# EAGLE schematic mainBoard (EAGLE 9.5.1)
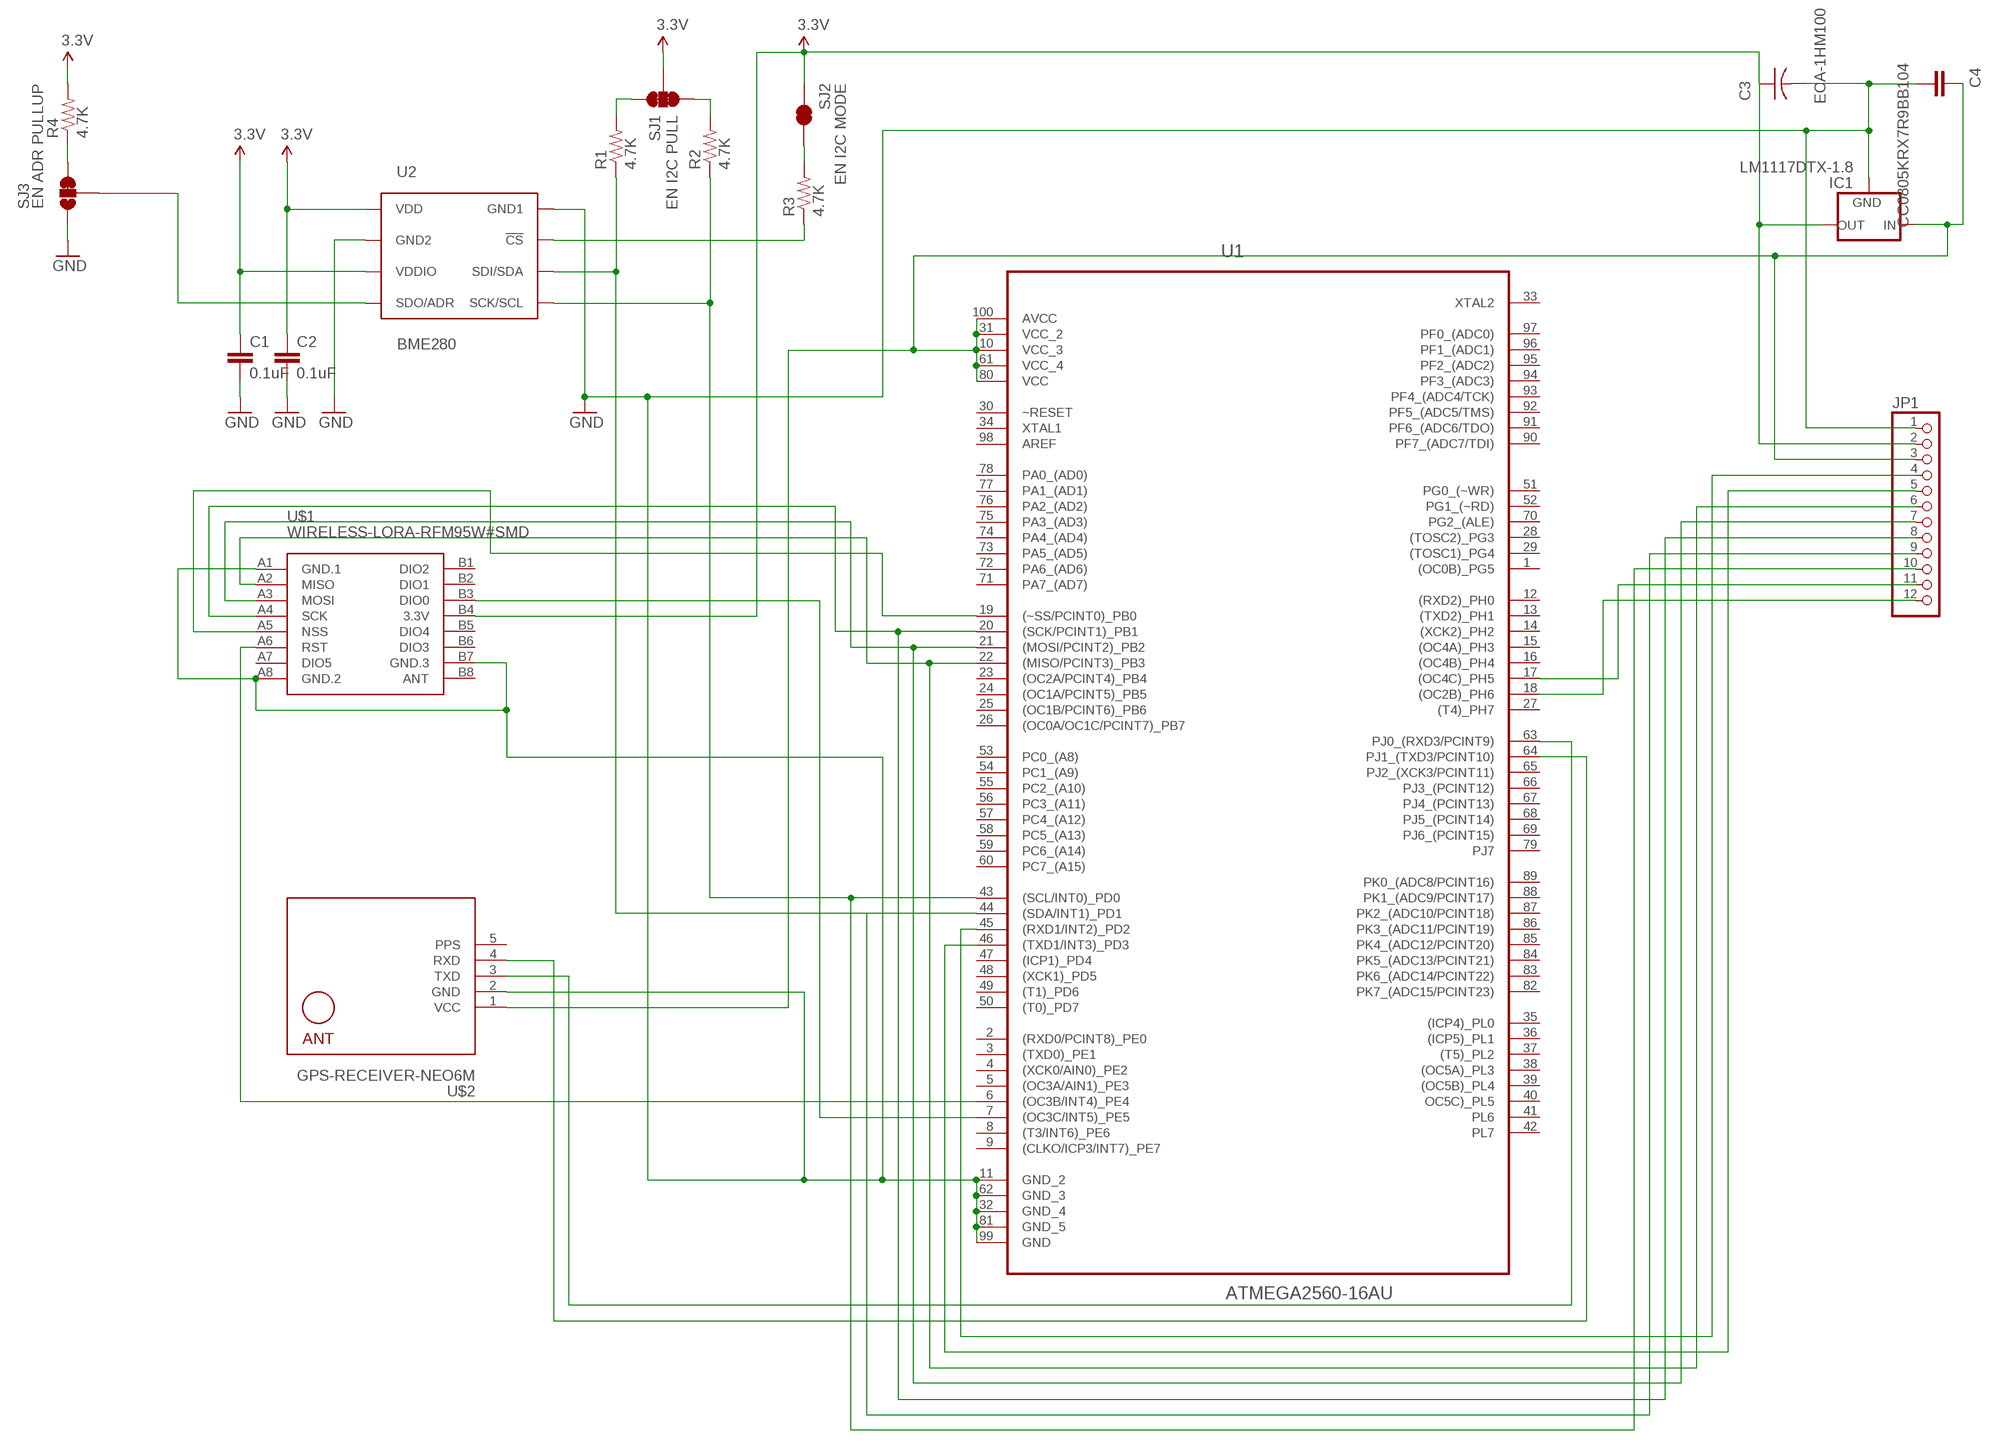
[diagram p0: schematic, sheet 1]

## Parts
C1  0.1uF  0.1UF-25V-5%(0603)  [0603-CAP]
C2  0.1uF  0.1UF-25V-5%(0603)  [0603-CAP]
C3  ECA-1HM100  [CAP_RADIAL_2MM]
C4  CC0805KRX7R9BB104  [CAP_0805]
IC1  LM1117DTX-1.8  [TO252]
JP1  PINHD-1X12  [1X12]
R1  4.7K  4.7KOHM-1/10W-1%(0603)  [0603-RES]
R2  4.7K  4.7KOHM-1/10W-1%(0603)  [0603-RES]
R3  4.7K  4.7KOHM-1/10W-1%(0603)  [0603-RES]
R4  4.7K  4.7KOHM-1/10W-1%(0603)  [0603-RES]
SJ1  EN I2C PULL  JUMPER-PAD-3-NC_BY_TRACE  [PAD-JUMPER-3-3OF3_NC_BY_TRACE_YES_SILK_FULL_BOX]
SJ2  EN I2C MODE  JUMPER-PAD-2-NC_BY_TRACE  [PAD-JUMPER-2-NC_BY_TRACE_YES_SILK]
SJ3  EN ADR PULLUP  JUMPER-PAD-3-2OF3_NC_BY_TRACE_SMALL  [PAD-JUMPER-3-2OF3_NC_BY_TRACE_YES_SILK_FULL_BOX]
U1  ATMEGA2560-16AU  [QFP50P1600X1600X120-100N]
U2  BME280  [BME280_LGA]
U$1  WIRELESS-LORA-RFM95W#SMD  [WIRELESS-LORA-RFM95W#SMD]
U$2  GPS-RECEIVER-NEO6M  [GPS-RECEIVER-NEO6M]

## Nets
3.3V: C1.1 C2.1 C3.1 IC1.TAB(OUT) JP1.2 R4.2 SJ1.2 SJ2.2 U2.P$6(VDDIO) U2.P$8(VDD) U$1.B4(3.3V)
!CS: R3.1 U2.P$2(!CS)
GND: C1.2 C2.2 C3.2 C4.2 IC1.1(GND) JP1.1 SJ3.1 U1.11(GND_2) U1.32(GND_4) U1.62(GND_3) U1.81(GND_5) U1.99(GND) U2.P$1(GND1) U2.P$7(GND2) U$1.A1(GND.1) U$1.A8(GND.2) U$1.B7(GND.3) U$2.2(GND)
N$1: JP1.4 U1.45((RXD1/INT2)_PD2)
N$2: JP1.5 U1.46((TXD1/INT3)_PD3)
N$3: R1.2 SJ1.3
N$4: R2.2 SJ1.1
N$5: R3.2 SJ2.1
N$6: R4.1 SJ3.3
N$7: JP1.6 U1.22((MISO/PCINT3)_PB3) U$1.A2(MISO)
N$8: JP1.7 U1.21((MOSI/PCINT2)_PB2) U$1.A3(MOSI)
N$9: JP1.8 U1.20((SCK/PCINT1)_PB1) U$1.A4(SCK)
N$10: U1.7((OC3C/INT5)_PE5) U$1.B3(DIO0)
N$11: U1.19((~SS/PCINT0)_PB0) U$1.A5(NSS)
N$12: U1.6((OC3B/INT4)_PE4) U$1.A6(RST)
N$13: U1.63(PJ0_(RXD3/PCINT9)) U$2.3(TXD)
N$14: U1.64(PJ1_(TXD3/PCINT10)) U$2.4(RXD)
N$15: C4.1 IC1.2(IN) JP1.3 U1.10(VCC_3) U1.31(VCC_2) U1.61(VCC_4) U1.80(VCC) U1.100(AVCC) U$2.1(VCC)
N$18: JP1.11 U1.17((OC4C)_PH5)
N$19: JP1.12 U1.18((OC2B)_PH6)
SCK/SCL: JP1.10 R2.1 U1.43((SCL/INT0)_PD0) U2.P$4(SCK/SCL)
SDI/SDA: JP1.9 R1.1 U1.44((SDA/INT1)_PD1) U2.P$3(SDI/SDA)
SDO/ADR: SJ3.2 U2.P$5(SDO/ADR)
Unconnected: U1.1((OC0B)_PG5) U1.2((RXD0/PCINT8)_PE0) U1.3((TXD0)_PE1) U1.4((XCK0/AIN0)_PE2) U1.5((OC3A/AIN1)_PE3) U1.8((T3/INT6)_PE6) U1.9((CLKO/ICP3/INT7)_PE7) U1.12((RXD2)_PH0) U1.13((TXD2)_PH1) U1.14((XCK2)_PH2) U1.15((OC4A)_PH3) U1.16((OC4B)_PH4) U1.23((OC2A/PCINT4)_PB4) U1.24((OC1A/PCINT5)_PB5) U1.25((OC1B/PCINT6)_PB6) U1.26((OC0A/OC1C/PCINT7)_PB7) U1.27((T4)_PH7) U1.28((TOSC2)_PG3) U1.29((TOSC1)_PG4) U1.30(~RESET) U1.33(XTAL2) U1.34(XTAL1) U1.35((ICP4)_PL0) U1.36((ICP5)_PL1) U1.37((T5)_PL2) U1.38((OC5A)_PL3) U1.39((OC5B)_PL4) U1.40(OC5C)_PL5) U1.41(PL6) U1.42(PL7) U1.47((ICP1)_PD4) U1.48((XCK1)_PD5) U1.49((T1)_PD6) U1.50((T0)_PD7) U1.51(PG0_(~WR)) U1.52(PG1_(~RD)) U1.53(PC0_(A8)) U1.54(PC1_(A9)) U1.55(PC2_(A10)) U1.56(PC3_(A11)) U1.57(PC4_(A12)) U1.58(PC5_(A13)) U1.59(PC6_(A14)) U1.60(PC7_(A15)) U1.65(PJ2_(XCK3/PCINT11)) U1.66(PJ3_(PCINT12)) U1.67(PJ4_(PCINT13)) U1.68(PJ5_(PCINT14)) U1.69(PJ6_(PCINT15)) U1.70(PG2_(ALE)) U1.71(PA7_(AD7)) U1.72(PA6_(AD6)) U1.73(PA5_(AD5)) U1.74(PA4_(AD4)) U1.75(PA3_(AD3)) U1.76(PA2_(AD2)) U1.77(PA1_(AD1)) U1.78(PA0_(AD0)) U1.79(PJ7) U1.82(PK7_(ADC15/PCINT23)) U1.83(PK6_(ADC14/PCINT22)) U1.84(PK5_(ADC13/PCINT21)) U1.85(PK4_(ADC12/PCINT20)) U1.86(PK3_(ADC11/PCINT19)) U1.87(PK2_(ADC10/PCINT18)) U1.88(PK1_(ADC9/PCINT17)) U1.89(PK0_(ADC8/PCINT16)) U1.90(PF7_(ADC7/TDI)) U1.91(PF6_(ADC6/TDO)) U1.92(PF5_(ADC5/TMS)) U1.93(PF4_(ADC4/TCK)) U1.94(PF3_(ADC3)) U1.95(PF2_(ADC2)) U1.96(PF1_(ADC1)) U1.97(PF0_(ADC0)) U1.98(AREF) U$1.A7(DIO5) U$1.B1(DIO2) U$1.B2(DIO1) U$1.B5(DIO4) U$1.B6(DIO3) U$1.B8(ANT)

## Power pins joined to a net without a drawn wire
PPS: U$2.5(PPS)

## Library data of the parts
C1 C2 = SparkFun-Capacitors:0.1UF-25V-5%(0603): CAP-08604; PROD_ID: CAP-08604
C3 = Resistor_Capacitor:ECA-1HM100: CAP ALUM 10UF 20% 50V RADIAL Manufacturer's datasheet <https://media.digikey.com/pdf/Data%20Sheets/Panasonic%20Electronic%20Components/ECA-xxM%20Series,TypeA.pdf>; CREATED_BY: PCBLayout.com; DIGIKEY_PART_NUMBER: P5178-ND; MANUFACTURER: Panasonic Electronic Components; MPN: ECA-1HM100; PACKAGE: CAP RADIAL 2MM LS
C4 = Resistor_Capacitor:CC0805KRX7R9BB104: CAP CER 0.1UF 50V X7R 0805 Manufacturer's datasheet <http://www.yageo.com/documents/recent/UPY-GPHC_X7R_6.3V-to-50V_18.pdf>; CREATED_BY: PCBLayout.com; DIGIKEY_PART_NUMBER: 311-1140-2-ND; MANUFACTURER: Yageo; MPN: CC0805KRX7R9BB104; PACKAGE: SMD 0805
IC1 = lm1117:LM1117DTX-*
JP1 = pinhead:PINHD-1X12: PIN HEADER
R1-R4 = SparkFun-Resistors:4.7KOHM-1/10W-1%(0603): RES-07857; PROD_ID: RES-07857
SJ1 = SparkFun-Passives:JUMPER-PAD-3-NC_BY_TRACE
SJ2 = SparkFun-Passives:JUMPER-PAD-2-NC_BY_TRACE
SJ3 = SparkFun-Passives:JUMPER-PAD-3-2OF3_NC_BY_TRACE
U1 = ATMEGA2560-16AU:ATMEGA2560-16AU: Microcontroller; AVAILABILITY: Unavailable; DESCRIPTION: AVR AVR® ATmega Microcontroller IC 8-Bit 16MHz 256KB _128K x 16_ FLASH 100-TQFP _14x14_; MF: Microchip; MP: ATMEGA2560-16AU; PACKAGE: TQFP-100 Atmel; PRICE: None
U2 = BME280ComponentLibrary:BME280; PROD_ID: IC-13090
U$1 = diy-modules (1):WIRELESS-LORA-RFM95W: 868/915 MHz LoRa Radio Transceiver Module based on SX1276 chip Click here to find device on ebay.com <http://www.ebay.com/sch/RFM95W+transceiver>
U$2 = diy-modules:GPS-RECEIVER-NEO6M: GPS Receiver Module based on NEO-6 device Short tutorial how to use NEO-6 module with Arduino: http://www.xarg.org/2016/06/neo6mv2-gps-module-with-arduino/ NEO-6 datasheet is available here: https://www.u-blox.com/sites/default/files/products/documents/NEO-6_DataSheet_%28GPS.G6-HW-09005%29.pdf Click here to find device on ebay.com <http://www.ebay.com/sch/gyneo6mv2>